# Altium schematic sheet Carte_Alim_CLAV.SchDoc
size A4; Author: Audran; CompanyName: Goldorak; Address1: Electrolab; Address2: 52 rue Paul Lescop; Address3: 92000 Nanterre; DocumentNumber: 5; SheetNumber: 5; SheetTotal: 5; ProjectName: Cartes_2017
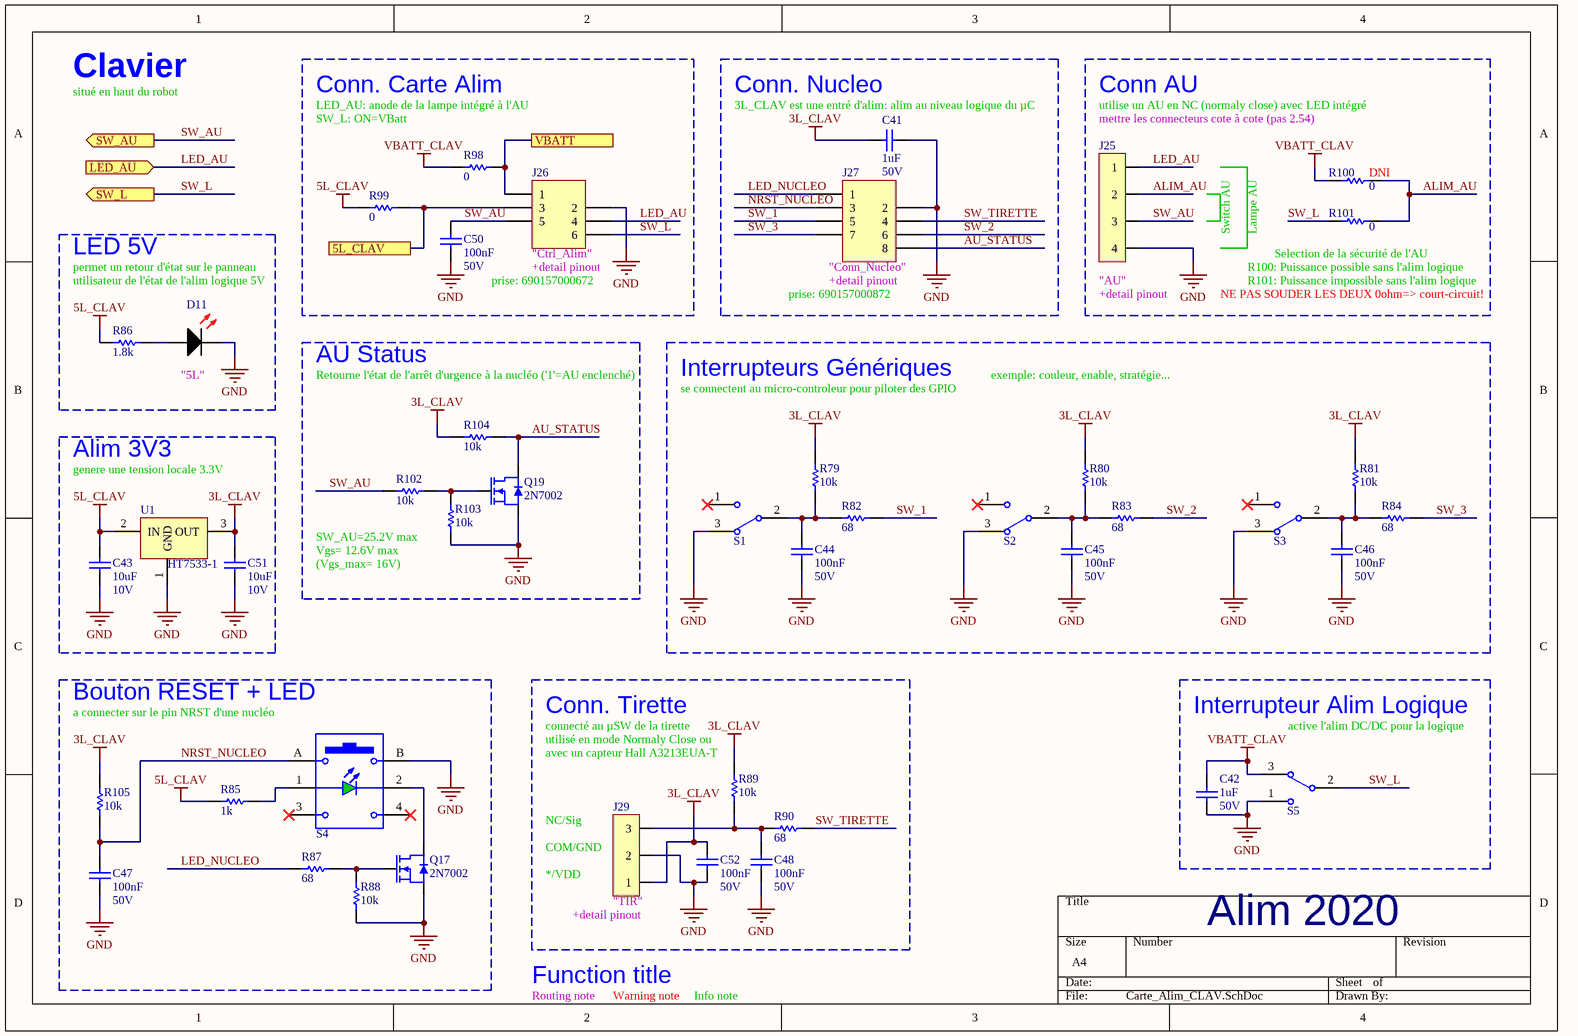
[diagram p0: Carte_Alim_CLAV.SchDoc]

## Parts
C41  1uF  RatedVoltage: 50V  [WCAP-CSGP_0805, 2x1.25x1.25]
C42  1uF  RatedVoltage: 50V  [WCAP-CSGP_0805, 2x1.25x1.25]
C43  10uF  RatedVoltage: 10V  [WCAP-CSGP_0805, 2x1.25x1.25]
C44  100nF  RatedVoltage: 50V  [WCAP-CSGP_0603, 1.6x0.8x0.8]
C45  100nF  RatedVoltage: 50V  [WCAP-CSGP_0603, 1.6x0.8x0.8]
C46  100nF  RatedVoltage: 50V  [WCAP-CSGP_0603, 1.6x0.8x0.8]
C47  100nF  RatedVoltage: 50V  [WCAP-CSGP_0603, 1.6x0.8x0.8]
C48  100nF  RatedVoltage: 50V  [WCAP-CSGP_0603, 1.6x0.8x0.8]
C50  100nF  RatedVoltage: 50V  [WCAP-CSGP_0603, 1.6x0.8x0.8]
C51  10uF  RatedVoltage: 10V  [WCAP-CSGP_0805, 2x1.25x1.25]
C52  100nF  RatedVoltage: 50V  [WCAP-CSGP_0603, 1.6x0.8x0.8]
D11  150060RS75000  [SMCW_0603]  (value not drawn)
J25  22-03-2041  [22-03-2041]  (value not drawn)
J26  690367280676  [690367280676]  (value not drawn)
J27  690367280876  [690367280876]  (value not drawn)
J29  22-03-2031  [22-03-2031]  (value not drawn)
Q17  2N7002  [SOT-23]
Q19  2N7002  [SOT-23]
R79  value 10k  [RESC1608X06N]  (hidden comment: RC0603FR-0710KL)
R80  value 10k  [RESC1608X06N]  (hidden comment: RC0603FR-0710KL)
R81  value 10k  [RESC1608X06N]  (hidden comment: RC0603FR-0710KL)
R82  value 68  [RESC1608X06N]  (hidden comment: RC0603FR-0768RL)
R83  value 68  [RESC1608X06N]  (hidden comment: RC0603FR-0768RL)
R84  value 68  [RESC1608X06N]  (hidden comment: RC0603FR-0768RL)
R85  value 1k  [RESC1608X06N]  (hidden comment: RC0603FR-071KL)
R86  value 1.8k  [RESC1608X06N]  (hidden comment: RC0603FR-071K8L)
R87  value 68  [RESC1608X06N]  (hidden comment: RC0603FR-0768RL)
R88  value 10k  [RESC1608X06N]  (hidden comment: RC0603FR-0710KL)
R89  value 10k  [RESC1608X06N]  (hidden comment: RC0603FR-0710KL)
R90  value 68  [RESC1608X06N]  (hidden comment: RC0603FR-0768RL)
R98  value 0  [RESC1608X06N]  (hidden comment: RC0603FR-070RL)
R99  value 0  [RESC1608X06N]  (hidden comment: RC0603FR-070RL)
R100  value 0  [RESC1608X06N]  (hidden comment: RC0603FR-070RL)
R101  value 0  [RESC1608X06N]  (hidden comment: RC0603FR-070RL)
R102  value 10k  [RESC1608X06N]  (hidden comment: RC0603FR-0710KL)
R103  value 10k  [RESC1608X06N]  (hidden comment: RC0603FR-0710KL)
R104  value 10k  [RESC1608X06N]  (hidden comment: RC0603FR-0710KL)
R105  value 10k  [RESC1608X06N]  (hidden comment: RC0603FR-0710KL)
S1  OS102011MS2QN1  [SW_OS102011MS2QN1]  (value not drawn)
S2  OS102011MS2QN1  [SW_OS102011MS2QN1]  (value not drawn)
S3  OS102011MS2QN1  [SW_OS102011MS2QN1]  (value not drawn)
S4  440GS67082622  [440xx67082622]  (value not drawn)
S5  OS102011MS2QN1  [SW_OS102011MS2QN1]  (value not drawn)
U1  HT7533-1  [SOT89-150P350X160-3N]

## Blocks framed on the sheet
Conn. Carte Alim: C50 J26 R98 R99
Conn. Nucleo: C41 J27
Conn AU: J25 R100 R101
LED 5V: D11 R86
AU Status: Q19 R102-R104
Interrupteurs Génériques: C44-C46 R79-R84 S1-S3
Alim 3V3: C43 C51 U1
Bouton RESET + LED: C47 Q17 R85 R87 R88 R105 S4
Conn. Tirette: C48 C52 J29 R89 R90
Interrupteur Alim Logique: C42 S5

## Ports
5L_CLAV, LED_AU (in), SW_AU (out), SW_L (out), VBATT

## Nets
3L_CLAV: C41.2 C51.1 C52.1 J29.1 R79.2 R80.2 R81.2 R89.2 R104.2 R105.2 U1.3(OUT)
5L_CLAV: C43.1 R85.1 R86.1 R99.2 U1.2(IN)
GND: C41.1 C42.1 C43.2 C44.2 C45.2 C46.2 C47.2 C48.2 C50.2 C51.2 C52.2 D11.1(C) J25.4 J26.2 J27.2 J29.2 Q17.2(S) Q19.2(S) R88.1 R103.1 S1.3 S2.3 S3.3 S4.B S5.1 U1.1(GND)
VBATT_CLAV: C42.2 R98.2 R100.1 S5.3
5L_CLAV: J26.3 R99.1 ; port 5L_CLAV  [a separate net that carries the same name]
ALIM_AU: J25.2 R100.2 R101.2
AU_STATUS: J27.8 Q19.3(D) R104.1
LED_AU: J25.1 J26.4 ; port LED_AU
LED_NUCLEO: J27.1 R87.1
NRST_NUCLEO: C47.1 J27.3 R105.1 S4.A
SW_1: J27.5 R82.2
SW_2: J27.6 R83.2
SW_3: J27.7 R84.2
SW_AU: C50.1 J25.3 J26.5 R102.2 ; port SW_AU
SW_L: J26.6 R101.1 S5.2 ; port SW_L
SW_TIRETTE: J27.4 R90.2
VBATT: J26.1 R98.1 ; port VBATT
NetC44_1: C44.1 R79.1 R82.1 S1.2
NetC45_1: C45.1 R80.1 R83.1 S2.2
NetC46_1: C46.1 R81.1 R84.1 S3.2
NetC48_1: C48.1 J29.3 R89.1 R90.1
NetD11_2: D11.2(A) R86.2
NetQ17_1: Q17.1(G) R87.2 R88.2
NetQ17_3: Q17.3(D) S4.2
NetQ19_1: Q19.1(G) R102.1 R103.2
NetR85_2: R85.2 S4.1

Not connected (* = marked no-connect by the designer): S1 1*; S2 1*; S3 1*; S4 3* 4*

## Notes on the sheet
- Clavier
- situé en haut du robot
- LED_AU: anode de la lampe intégré à l'AU
- (near C41) 3L_CLAV est une entré d'alim: alim au niveau logique du µC
- utilise un AU en NC (normaly close) avec LED intégré
- SW_L: ON=VBatt
- mettre les connecteurs cote à cote (pas 2.54)
- (near R100) DNI
- Switch AU
- Lampe AU
- permet un retour d'état sur le panneau
- utilisateur de l'état de l'alim logique 5V
- prise: 690157000672
- (near J26) "Ctrl_Alim"
- (near J26) +detail pinout
- (near J27) prise: 690157000872
- (near J27) "Conn_Nucleo"
- (near J27) +detail pinout
- (near J25) "AU"
- (near J25) +detail pinout
- NE PAS SOUDER LES DEUX 0ohm=> court-circuit!
- (near R101) R100: Puissance possible sans l'alim logique
- R101: Puissance impossible sans l'alim logique
- (near R101) Selection de la sécurité de l'AU
- (near D11) "5L"
- Retourne l'état de l'arrêt d'urgence à la nucléo ('1'=AU enclenché)
- exemple: couleur, enable, stratégie...
- se connectent au micro-controleur pour piloter des GPIO
- genere une tension locale 3.3V
- SW_AU=25.2V max
- Vgs= 12.6V max
- (Vgs_max= 16V)
- (near S4) a connecter sur le pin NRST d'une nucléo
- (near R89) connecté au µSW de la tirette
- (near R89) utilisé en mode Normaly Close ou
- (near R89) avec un capteur Hall A3213EUA-T
- (near S5) active l'alim DC/DC pour la logique
- (near J29) COM/GND
- NC/Sig
- */VDD
- (near J29) +detail pinout
- (near J29) "TIR"
- Function title
- Alim 2020
- Routing note
- Warning note
- Info note
- Title
- Size:
- Date:
- A4
- Number:
- Time:
- Revision:
- Sheet
- of
- File:

## Library data of the parts
C41 C42 = WCAP-CSGP, 885012207103: CAP CER 1uF 50V X7R 0805; Manufacturer: Wurth Elektronik; ComponentLink1Description: Datasheet; ComponentLink1URL: http://katalog.we-online.com/pbs/datasheet/885012207103.pdf; Manufacturer Part Number: 885012207103; Value: 1uF; Size: 0805; CeramicType: X7R; Supplier 2: JLCPCB; Supplier Part Number 2: C28323; Supplier Footprint 2: 0805
C43 C51 = WCAP-CSGP, 885012207026: CAP CER 10uF 10V X7R 0805; Manufacturer: Wurth Elektronik; ComponentLink1Description: Datasheet; ComponentLink1URL: http://katalog.we-online.com/pbs/datasheet/885012207026.pdf; Value: 10uF; Size: 0805; CeramicType: X7R; Manufacturer Part Number: 885012207026; Supplier 2: JLCPCB; Supplier Part Number 2: C15850; Supplier 1: Farnell; Supplier Part Number 1: 2495189; Supplier Footprint 2: 0805
C44-C48 C50 C52 = WCAP-CSGP, 885012206095: CAP CER 100nF 50V X7R 0603; Manufacturer: Wurth Elektronik; ComponentLink1Description: Datasheet; ComponentLink1URL: http://katalog.we-online.com/pbs/datasheet/885012206095.pdf; Value: 100nF; Size: 0603; CeramicType: X7R; Manufacturer Part Number: 885012206095; Supplier 2: JLCPCB; Supplier Part Number 2: C14663; Supplier Footprint 2: 0603
D11 = WL-SMCW 0603  150060RS75000: SMD mono-color Chip LED, WL-SMCW, Red; Manufacturer: Wurth Elektronik; Value: Rouge; Manufacturer Part Number: 150060RS75000; ComponentLink1Description: Datasheet; ComponentLink1URL: http://katalog.we-online.com/led/datasheet/150060RS75000.pdf; Supplier 1: Farnell; Supplier Part Number 1: 2322071; Supplier 2: JLCPCB; Supplier Part Number 2: C2286; Supplier Footprint 2: LED_0603
J25 = 22-03-2041: CONN HEADER VERT 4POS 2.54MM; Manufacturer: MOLEX; Supplier 1: Farnell; Supplier Part Number 1: 9731091; Manufacturer Part Number: 22-03-2041; ComponentLink1URL: https://www.molex.com/pdm_docs/sd/022032041_sd.pdf; ComponentLink1Description: Datasheet
J26 = 690367280676: WR-MM 6p Female SMT Connector with Polarization; Manufacturer: Wurth Electronics Inc.; Value: 6; ComponentLink1Description: Datasheet; ComponentLink1URL: http://katalog.we-online.de/em/datasheet/69036728xx76.pdf; Manufacturer Part Number: 690367280676; Supplier 1: Farnell; Supplier Part Number 1: 1641849
J27 = 690367280876: WR-MM 8p Female SMT Connector with Polarization; Manufacturer: Wurth Electronics Inc.; Value: 8; Manufacturer Part Number: 690367280876; ComponentLink1Description: Datasheet; ComponentLink1URL: http://katalog.we-online.de/em/datasheet/69036728xx76.pdf; Supplier 1: Farnell; Supplier Part Number 1: 1641850
J29 = 22-03-2031: CONN HEADER VERT 3POS 2.54MM; Manufacturer: MOLEX; Supplier 1: Farnell; Supplier Part Number 1: 9731083; Manufacturer Part Number: 22-03-2031; ComponentLink1URL: http://www.farnell.com/datasheets/1785732.pdf; ComponentLink1Description: Datasheet; ComponentLink2URL: http://www.farnell.com/cad/495071.pdf  http://www.farnell.com/cad/1533907.pdf  http://www.farnell.com/cad/1533907.pdf; ComponentLink2Description: Drawings
Q17 Q19 = 2N7002: MOSFET N 60V 115MA SOT23; Manufacturer: Changjiang Electronics Tech (CJ); Supplier 1: Farnell; Supplier Part Number 1: 1510761; Manufacturer Part Number: 2N7002; ComponentLink1Description: Datasheet; ComponentLink1URL: https://datasheet.lcsc.com/szlcsc/1810151612_Changjiang-Electronics-Tech-CJ-2N7002_C8545.pdf; Supplier 2: JLCPCB; Supplier Part Number 2: C8545; Supplier Footprint 2: SOT-23-3
R79-R81 R88 R89 R102-R105 = RC0603FR-0710KL: RES SMD 10K OHM 1% 1/10W 0603; Manufacturer: Yageo; Power: 100mW; Vmax: 50V; Manufacturer Part Number: RC0603FR-0710KL; Type: Thick Film; ComponentLink1Description: Manufacturer; ComponentLink1URL: http://www.yageo.com/NewPortal/_en/index.jsp; ComponentLink2Description: Datasheet; ComponentLink2URL: http://www.farnell.com/datasheets/2167052.pdf; Supplier 1: Farnell; Supplier Part Number 1: 9238603; Precision: ±1%; Supplier 2: JLCPCB; Supplier Part Number 2: C25804; Supplier Footprint 2: 0603
R82-R84 R87 R90 = RC0603FR-0768RL: RES SMD 68 OHM 1% 1/10W 0603; Manufacturer: Yageo; Power: 100mW; Vmax: 50V; Manufacturer Part Number: RC0603FR-0768RL; Type: Thick Film; ComponentLink1Description: Manufacturer; ComponentLink1URL: http://www.yageo.com/NewPortal/_en/index.jsp; ComponentLink2Description: Datasheet; ComponentLink2URL: http://www.farnell.com/datasheets/1868787.pdf; Supplier 1: Farnell; Supplier Part Number 1: 9238344; Precision: ±1%; Supplier 2: JLCPCB; Supplier Part Number 2: C27592; Supplier Footprint 2: 0603
R85 = RC0603FR-071KL: RES SMD 1K OHM 1% 1/10W 0603; Manufacturer: Yageo; Power: 100mW; Vmax: 50V; Manufacturer Part Number: RC0603FR-071KL; Type: Thick Film; ComponentLink1Description: Manufacturer; ComponentLink1URL: http://www.yageo.com/NewPortal/_en/index.jsp; ComponentLink2Description: Datasheet; ComponentLink2URL: http://www.farnell.com/datasheets/2167052.pdf; Precision: ±1%; Supplier 1: Farnell; Supplier Part Number 1: 9238484; Supplier 2: JLCPCB; Supplier Part Number 2: C21190; Supplier Footprint 2: 0603
R86 = RC0603FR-071K8L: RES SMD 1.8K OHM 1% 1/10W 0603; Manufacturer: Yageo; Power: 100mW; Vmax: 50V; Manufacturer Part Number: RC0603FR-071K8L; Type: Thick Film; ComponentLink1Description: Manufacturer; ComponentLink1URL: http://www.yageo.com/NewPortal/_en/index.jsp; ComponentLink2Description: Datasheet; ComponentLink2URL: http://www.farnell.com/datasheets/2167052.pdf; Precision: ±1%; Supplier 1: Farnell; Supplier Part Number 1: 9238514; Supplier 2: JLCPCB; Supplier Part Number 2: C4177; Supplier Footprint 2: 0603
R98-R101 = RC0603FR-070RL: RES SMD 0 OHM 1% 1/10W 0603; Manufacturer: Yageo; Power: 100mW; Vmax: 50V; ComponentLink1Description: Manufacturer; ComponentLink1URL: http://www.yageo.com/NewPortal/_en/index.jsp; ComponentLink2Description: Datasheet; ComponentLink2URL: http://www.farnell.com/datasheets/2167052.pdf; Manufacturer Part Number: RC0603FR-070RL; Type: Thick Film; Supplier 1: Farnell; Precision: ±1%; Supplier Part Number 1: 2309106; Supplier 2: JLCPCB; Supplier Part Number 2: C21189; Supplier Footprint 2: 0603
S1-S3 S5 = OS102011MS2QN1: SWITCH SLIDE SPDT 0.1A 12V (500VDC max); Manufacturer: C & K COMPONENTS; Supplier 1: Farnell; Supplier Part Number 1: 1201430; Manufacturer Part Number: OS102011MS2QN1; ComponentLink2URL: https://www.ckswitches.com/products/switches/product-details/Slide/OS/OS102011MS2QN1/; ComponentLink2Description: Manufacturer; ComponentLink1Description: Datasheet; ComponentLink1URL: https://www.ckswitches.com/media/1428/os.pdf
S4 = 440GS67082622: WS-TATL Illuminated THT Tact Switch, Green; Manufacturer: Wurth Elektronik; ComponentLink1Description: Datasheet; ComponentLink1URL: https://katalog.we-online.com/em/datasheet/440GS67082622.pdf; ComponentLink2Description: Manufacturer; ComponentLink2URL: https://www.we-online.com/catalog/en/TATL_12X12_THT/?sq=440GS67082622#440GS67082622; Manufacturer Part Number: 440GS67082622; Supplier 1: Farnell; Supplier Part Number 1: 2402381
U1 = HT7533-1: LDO 3.3V 100mA SOT89; Manufacturer: Holtek; Manufacturer Part Number: HT7533-1; ComponentLink1URL: https://datasheet.lcsc.com/szlcsc/1812071811_Holtek-Semicon-HT7533-1_C14289.pdf; ComponentLink1Description: Datasheet; ComponentLink2Description: Manufacturer; ComponentLink2URL: https://www.holtek.com/productdetail/-/vg/75xx_1; Type: LDO; Value: 3.3V; Supplier 1: RSComponents; Supplier Part Number 1: 8850721; Supplier 2: JLCPCB; Supplier Part Number 2: C14289; Supplier Footprint 2: SOT-89-3